# Altium schematic sheet RGB_LED_Schematic.SchDoc
size A4
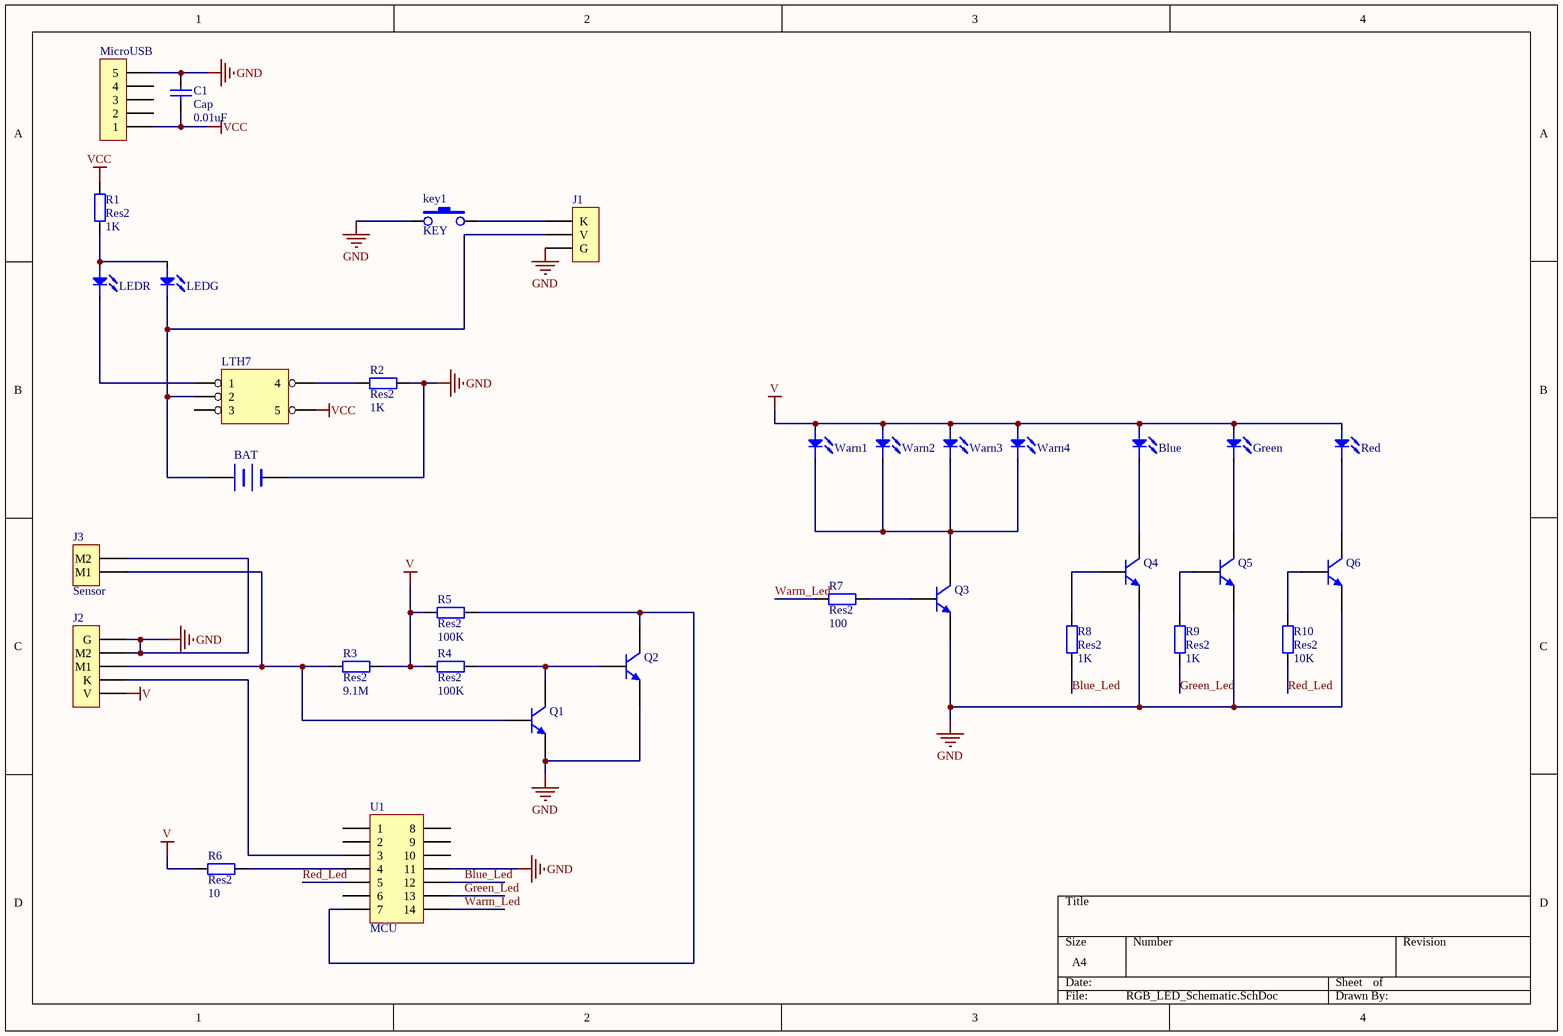
[diagram p0: RGB_LED_Schematic.SchDoc]

## Parts
BAT  干电池  (value not drawn)
Blue  LEDG  [LED]  (value not drawn)
C1  Cap  value 0.01uF  [RAD-0.3]
Green  LEDG  [LED]  (value not drawn)
J1  CON3  [DG1283-5.0]  (value not drawn)
J2  CON5  [DG1285-5.0]  (value not drawn)
J3  Sensor
key1  KEY  [AN12]
LEDG  LEDG  [LED]  (value not drawn)
LEDR  LEDR  [LED]  (value not drawn)
LTH7  HEADER 3X2  (value not drawn)
MicroUSB  CON5  [DG1285-5.0]  (value not drawn)
Q1  2N3904  [BCY-W3/E4]  (value not drawn)
Q2  2N3904  [BCY-W3/E4]  (value not drawn)
Q3  2N3904  [BCY-W3/E4]  (value not drawn)
Q4  2N3904  [BCY-W3/E4]  (value not drawn)
Q5  2N3904  [BCY-W3/E4]  (value not drawn)
Q6  2N3904  [BCY-W3/E4]  (value not drawn)
R1  Res2  value 1K  [AXIAL-0.4]
R2  Res2  value 1K  [AXIAL-0.4]
R3  Res2  value 9.1M  [AXIAL-0.4]
R4  Res2  value 100K  [AXIAL-0.4]
R5  Res2  value 100K  [AXIAL-0.4]
R6  Res2  value 10  [AXIAL-0.4]
R7  Res2  value 100  [AXIAL-0.4]
R8  Res2  value 1K  [AXIAL-0.4]
R9  Res2  value 1K  [AXIAL-0.4]
R10  Res2  value 10K  [AXIAL-0.4]
Red  LEDG  [LED]  (value not drawn)
U1  MCU  [HDR2X7_CEN]
Warn1  LEDG  [LED]  (value not drawn)
Warn2  LEDG  [LED]  (value not drawn)
Warn3  LEDG  [LED]  (value not drawn)
Warn4  LEDG  [LED]  (value not drawn)

## Nets
GND: BAT.2(-) C1.2 J1.3(G) J2.4(M2) J2.5(G) J3.2(M2) key1.1 MicroUSB.5 Q1.1(E) Q2.1(E) Q3.1(E) Q4.1(E) Q5.1(E) Q6.1(E) R2.2 U1.11
V: Blue.A Green.A J2.1(V) R3.2 R4.1 R5.1 R6.1 Red.A Warn1.A Warn2.A Warn3.A Warn4.A
VCC: C1.1 LTH7.6(5) MicroUSB.1 R1.2
Blue_Led: R8.1 U1.12
Green_Led: R9.1 U1.13
Red_Led: R10.1 U1.5
Warm_Led: R7.1 U1.14
NetBAT_1: BAT.1(+) J1.2(V) LEDG.K LTH7.3(2)
NetBlue_K: Blue.K Q4.3(C)
NetGreen_K: Green.K Q5.3(C)
NetJ1_1: J1.1(K) key1.2
NetJ2_2: J2.2(K) U1.3
NetJ2_3: J2.3(M1) J3.1(M1) Q1.2(B) R3.1
NetLEDG_A: LEDG.A LEDR.A R1.1
NetLEDR_K: LEDR.K LTH7.1
NetLTH7_2: LTH7.2(4) R2.1
NetQ1_3: Q1.3(C) Q2.2(B) R4.2
NetQ2_3: Q2.3(C) R5.2 U1.7
NetQ3_2: Q3.2(B) R7.2
NetQ3_3: Q3.3(C) Warn1.K Warn2.K Warn3.K Warn4.K
NetQ4_2: Q4.2(B) R8.2
NetQ5_2: Q5.2(B) R9.2
NetQ6_2: Q6.2(B) R10.2
NetQ6_3: Q6.3(C) Red.K
NetR6_2: R6.2 U1.4

Not connected (* = marked no-connect by the designer): LTH7 4 5(3); MicroUSB 2 3 4; U1 1 2 6 8 9 10

## Library data of the parts
BAT = 干电池: Battery
Blue Green LEDG LEDR Red Warn1-Warn4 = LED
C1 = Cap: Capacitor; Published: 8-Jun-2000; LatestRevisionDate: 17-Jul-2002; LatestRevisionNote: Re-released for DXP Platform.; PackageReference: RAD-0.3; Publisher: Altium Limited
J3 = CON2: Connector
Q1-Q6 = 2N3904: NPN General Purpose Amplifier; Published: 8-Jun-2000; LatestRevisionDate: 15-Jan-2003; LatestRevisionNote: PCB Footprint 'BCY-W3/D4.7' replaced; DatasheetVersion: 1997; PackageVersion: Sep-1998; PackageReference: TO-92A; Publisher: Altium Limited; Code_JEDEC: TO-92A; ComponentLink1Description: Manufacturer Link; ComponentLink1URL: http://www.fairchildsemi.com/; ComponentLink2Description: Datasheet; ComponentLink2URL: http://www.fairchildsemi.com/ds/2N%2F2N3904.pdf
R1-R10 = Res2: Resistor; Published: 8-Jun-2000; LatestRevisionDate: 17-Jul-2002; LatestRevisionNote: Re-released for DXP Platform.; PackageReference: AXIAL-0.4; Publisher: Altium Limited
U1 = Header 7X2A: Header, 7-Pin, Dual row; LatestRevisionDate: 17-Jul-2002; LatestRevisionNote: Re-released for DXP Platform.; Publisher: Altium Limited